# EAGLE design G848L (EAGLE 6.6.0)
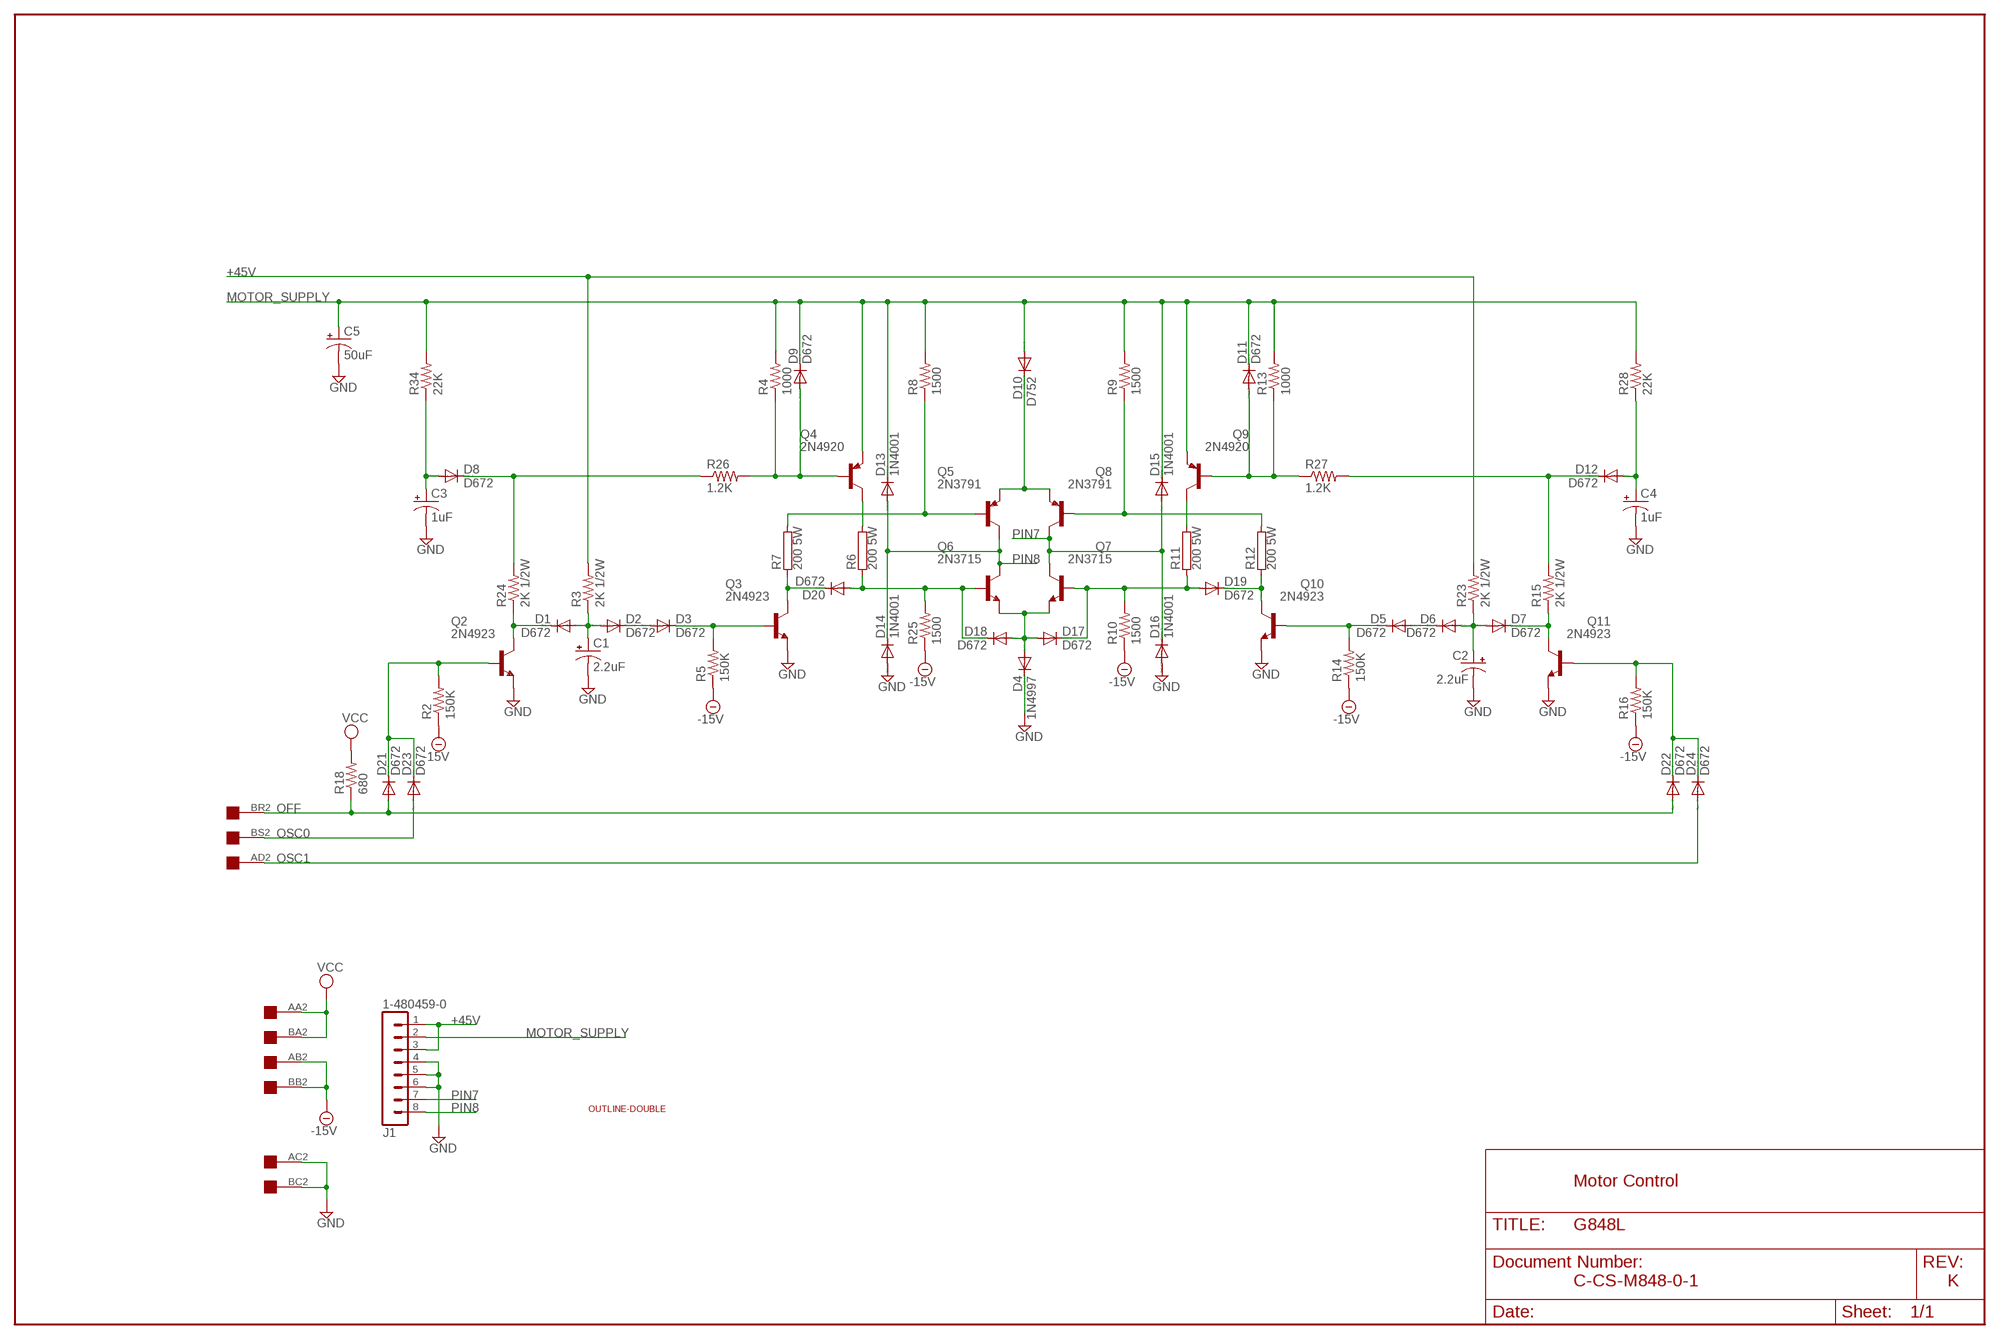
[diagram p0: schematic, sheet 1]

## Parts
C1  2.2uF  CPOL-USE15-5AXIAL  [E15-5]
C2  2.2uF  CPOL-USE15-5AXIAL  [E15-5]
C3  1uF  CPOL-USE15-5AXIAL  [E15-5]
C4  1uF  CPOL-USE15-5AXIAL  [E15-5]
C5  50uF  CPOL-USE30-10AXIAL  [E30-10]
D1  D672  DIODE-DO35-10  [DO35-10]
D2  D672  DIODE-DO35-10  [DO35-10]
D3  D672  DIODE-DO35-10  [DO35-10]
D4  1N4997  DIODE-G4-12  [G4-12]
D5  D672  DIODE-DO35-10  [DO35-10]
D6  D672  DIODE-DO35-10  [DO35-10]
D7  D672  DIODE-DO35-10  [DO35-10]
D8  D672  DIODE-DO35-10  [DO35-10]
D9  D672  DIODE-DO35-10  [DO35-10]
D10  D752  DIODE-G4-12  [G4-12]
D11  D672  DIODE-DO35-10  [DO35-10]
D12  D672  DIODE-DO35-10  [DO35-10]
D13  1N4001  1N4004  [DO41-10]
D14  1N4001  1N4004  [DO41-10]
D15  1N4001  1N4004  [DO41-10]
D16  1N4001  1N4004  [DO41-10]
D17  D672  DIODE-DO35-10  [DO35-10]
D18  D672  DIODE-DO35-10  [DO35-10]
D19  D672  DIODE-DO35-10  [DO35-10]
D20  D672  DIODE-DO35-10  [DO35-10]
D21  D672  DIODE-DO35-10  [DO35-10]
D22  D672  DIODE-DO35-10  [DO35-10]
D23  D672  DIODE-DO35-10  [DO35-10]
D24  D672  DIODE-DO35-10  [DO35-10]
J1  1-480459-0  [1-480459-0]
Q2  2N4923  -NPN-TO225HH  [TO225AHH]
Q3  2N4923  -NPN-TO225HH  [TO225AHH]
Q4  2N4920  -PNP-TO225HH  [TO225AHH]
Q5  2N3791  -PNP-TO3  [TO3]
Q6  2N3715  -NPN-TO3/  [TO3]
Q7  2N3715  -NPN-TO3/  [TO3]
Q8  2N3791  -PNP-TO3  [TO3]
Q9  2N4920  -PNP-TO225HH  [TO225AHH]
Q10  2N4923  -NPN-TO225HH  [TO225AHH]
Q11  2N4923  -NPN-TO225HH  [TO225AHH]
R2  150K  R-US_0207/10  [0207/10]
R3  2K 1/2W  R-US_0411/15  [0411/15]
R4  1000  R-US_0207/10  [0207/10]
R5  150K  R-US_0207/10  [0207/10]
R6  200 5W  RCA4090  [CA4090]
R7  200 5W  RCA4090  [CA4090]
R8  1500  R-US_0207/10  [0207/10]
R9  1500  R-US_0207/10  [0207/10]
R10  1500  R-US_0207/10  [0207/10]
R11  200 5W  RCA4090  [CA4090]
R12  200 5W  RCA4090  [CA4090]
R13  1000  R-US_0207/10  [0207/10]
R14  150K  R-US_0207/10  [0207/10]
R15  2K 1/2W  R-US_0411/15  [0411/15]
R16  150K  R-US_0207/10  [0207/10]
R18  680  R-US_0207/10  [0207/10]
R23  2K 1/2W  R-US_0411/15  [0411/15]
R24  2K 1/2W  R-US_0411/15  [0411/15]
R25  1500  R-US_0207/10  [0207/10]
R26  1.2K  R-US_0207/10  [0207/10]
R27  1.2K  R-US_0207/10  [0207/10]
R28  22K  R-US_0207/10  [0207/10]
R34  22K  R-US_0207/10  [0207/10]
U$1  DOUBLE  [EDGE-CON4]
U$2  OUTLINE-DOUBLE  [DOUBLE]

## Nets
+45V: J1.1 J1.3 R3.2 R23.2
-15V: R2.1 R5.1 R10.1 R14.1 R16.1 R25.1 U$1.AB2 U$1.BB2
GND: C1.- C2.- C3.- C4.- C5.- D4.C D14.A D16.A J1.4 J1.5 J1.6 Q2.1(E) Q3.1(E) Q10.1(E) Q11.1(E) U$1.AC2 U$1.BC2
MOTOR_SUPPLY: C5.+ D9.C D10.A D11.C D13.C D15.C J1.2 Q4.1(E) Q9.1(E) R4.2 R8.2 R9.2 R13.2 R28.2 R34.2
N$1: D21.C D23.C Q2.3(B) R2.2
N$2: D2.C D3.A
N$3: D5.A D6.C
N$4: C3.+ D8.A R34.1
N$5: D1.C Q2.2(C) R24.1
N$6: C1.+ D1.A D2.A R3.1
N$7: D8.C R24.2 R26.1
N$9: D3.C Q3.3(B) R5.2
N$10: Q4.2(C) R6.2
N$11: D20.C Q3.2(C) R7.1
N$12: Q5.B R7.2 R8.1
N$13: D18.C D20.A Q6.B R6.1 R25.2
N$14: D9.A Q4.3(B) R4.1 R26.2
N$15: D17.C D19.A Q7.B R10.2 R11.1
N$16: D4.A D17.A D18.A Q6.E Q7.E
N$17: D10.C Q5.E Q8.E
N$18: Q8.B R9.1 R12.2
N$19: Q9.2(C) R11.2
N$20: D19.C Q10.2(C) R12.1
N$21: D11.A Q9.3(B) R13.1 R27.1
N$22: D5.C Q10.3(B) R14.2
N$23: C2.+ D6.A D7.A R23.1
N$24: D7.C Q11.2(C) R15.1
N$25: D22.C D24.C Q11.3(B) R16.2
N$27: D12.C R15.2 R27.2
N$28: C4.+ D12.A R28.1
OFF: D21.A D22.A R18.1 U$1.BR2
OSC0: D23.A U$1.BS2
OSC1: D24.A U$1.AD2
PIN7: D15.A D16.C J1.7 Q7.C Q7.C/(C) Q8.C Q8.C/(C)
PIN8: D13.A D14.C J1.8 Q5.C Q5.C/(C) Q6.C Q6.C/(C)
VCC: R18.2 U$1.AA2 U$1.BA2
Unconnected: U$1.AA1 U$1.AB1 U$1.AC1 U$1.AD1 U$1.AE1 U$1.AE2 U$1.AF1 U$1.AF2 U$1.AH1 U$1.AH2 U$1.AJ1 U$1.AJ2 U$1.AK1 U$1.AK2 U$1.AL1 U$1.AL2 U$1.AM1 U$1.AM2 U$1.AN1 U$1.AN2 U$1.AP1 U$1.AP2 U$1.AR1 U$1.AR2 U$1.AS1 U$1.AS2 U$1.AT1 U$1.AT2 U$1.AU1 U$1.AU2 U$1.AV1 U$1.AV2 U$1.BA1 U$1.BB1 U$1.BC1 U$1.BD1 U$1.BD2 U$1.BE1 U$1.BE2 U$1.BF1 U$1.BF2 U$1.BH1 U$1.BH2 U$1.BJ1 U$1.BJ2 U$1.BK1 U$1.BK2 U$1.BL1 U$1.BL2 U$1.BM1 U$1.BM2 U$1.BN1 U$1.BN2 U$1.BP1 U$1.BP2 U$1.BR1 U$1.BS1 U$1.BT1 U$1.BT2 U$1.BU1 U$1.BU2 U$1.BV1 U$1.BV2

## Notes on the sheet
- Motor Control
- C-CS-M848-0-1 | K

## Library data of the parts
C1-C4 = dec-con:CPOL-USE15-5AXIAL: 0.6" version of an electrolytic
C5 = rcl:CPOL-US: POLARIZED CAPACITOR, American symbol
D1-D12 D17-D24 = diode:DIODE-: DIODE
D13-D16 = diode:1N4004: DIODE general purpose rectifier, 1 A
J1 = dec-con:1-480459-0: Mate-N-Lok 1-480459-0, board mounted.
Q2 Q3 Q6 Q7 Q10 Q11 = dec-con:*-NPN-: NPN Transistror BF959 corrected 2008.03.06
Q4 Q5 Q8 Q9 = dec-con:*-PNP-: PNP Transistror
R2-R5 R8-R10 R13-R16 R18 R23-R28 R34 = rcl:R-US_: RESISTOR, American symbol
R6 R7 R11 R12 = resistor-power:R: Power Resitor; OC_FARNELL: unknown; OC_NEWARK: unknown
U$1 = dec-con:DOUBLE: Double-Height DEC board
U$2 = dec-con:OUTLINE-*: Board outlines for DEC boards.

## Board
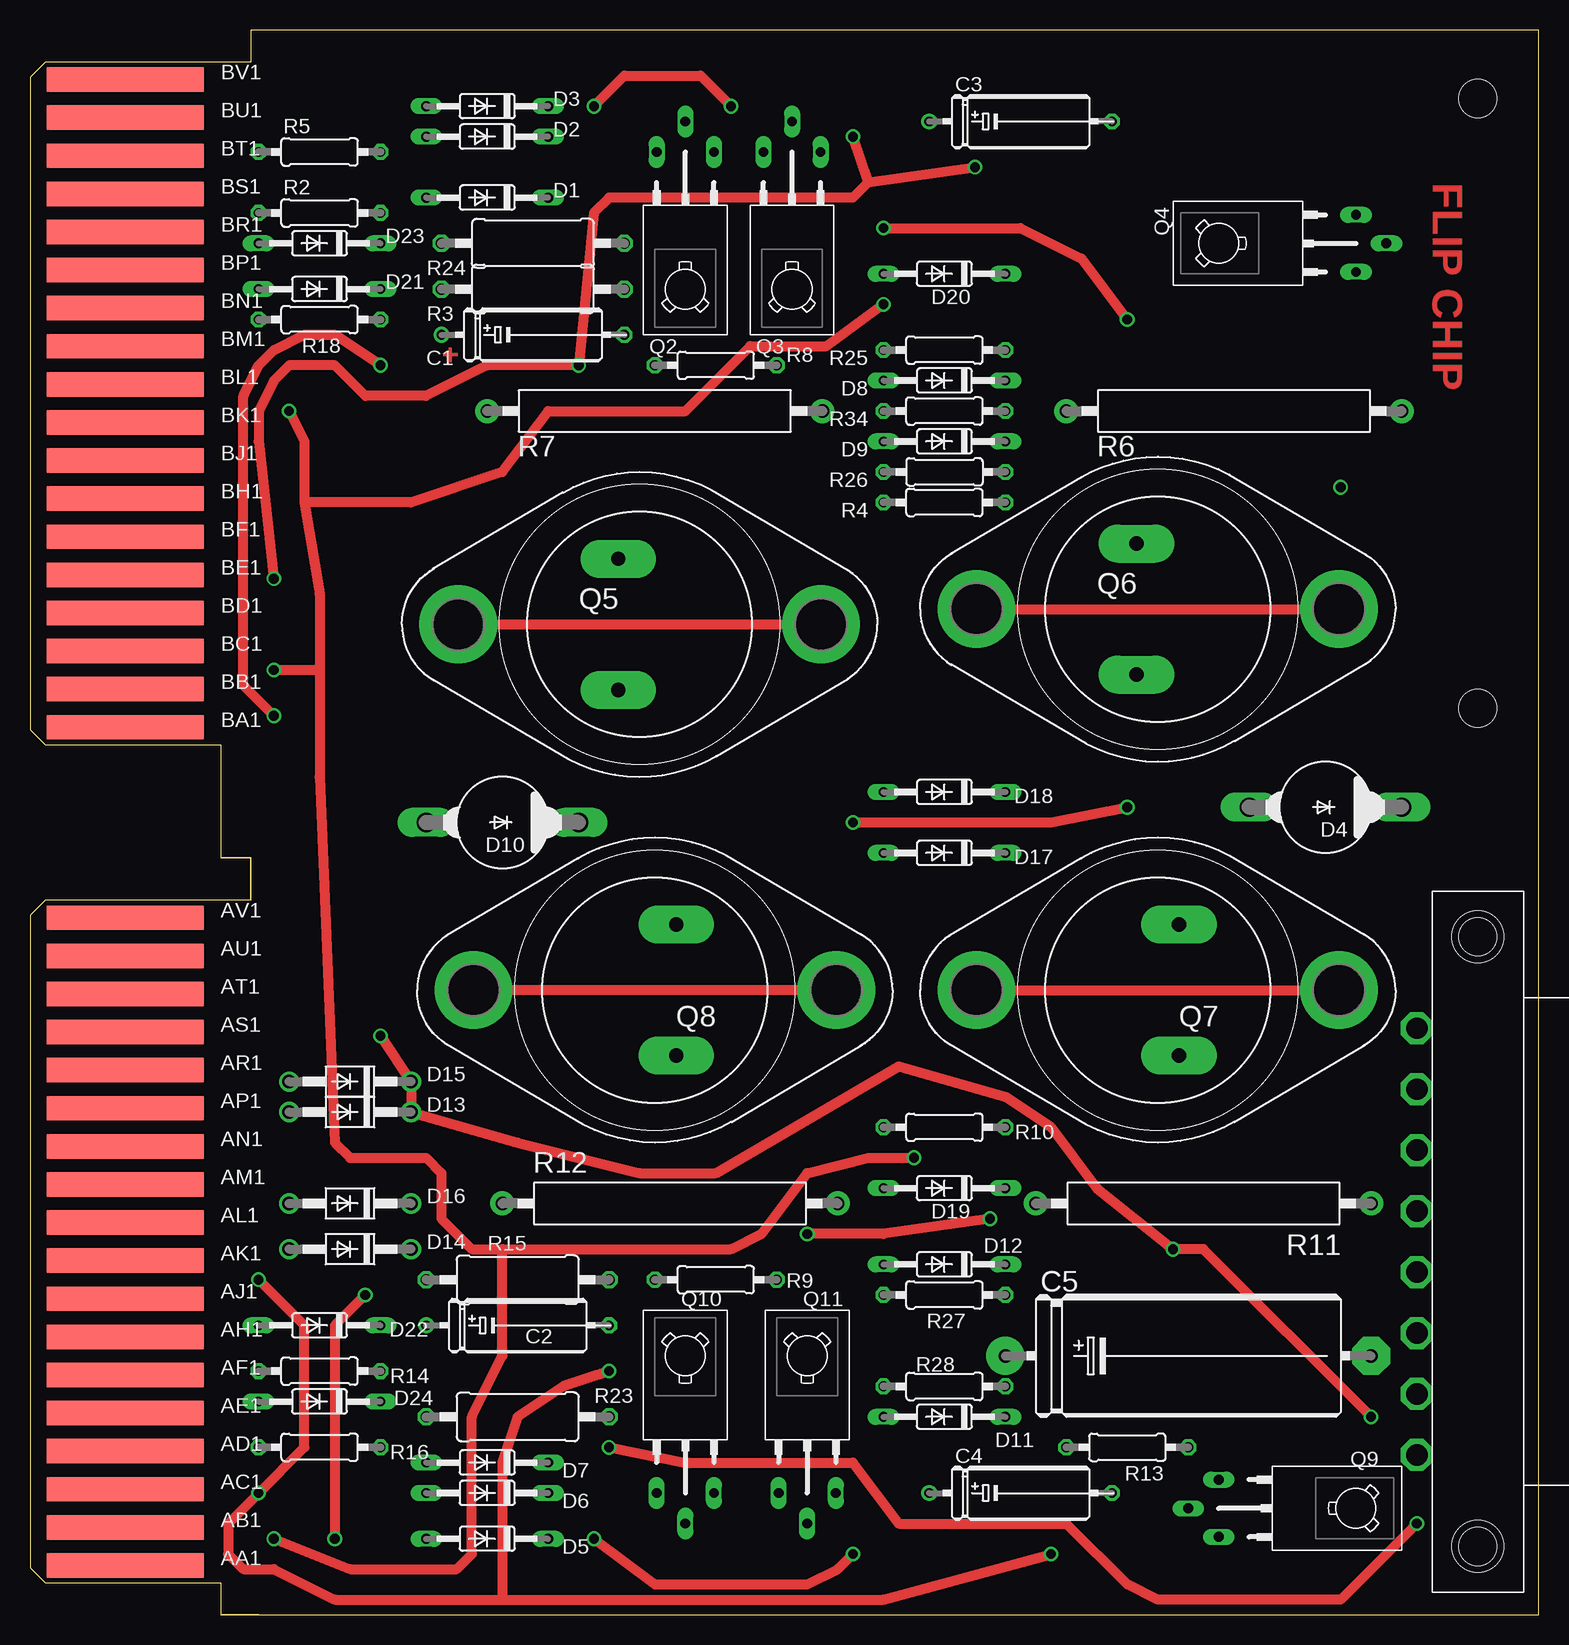
[diagram p1: board, top side]
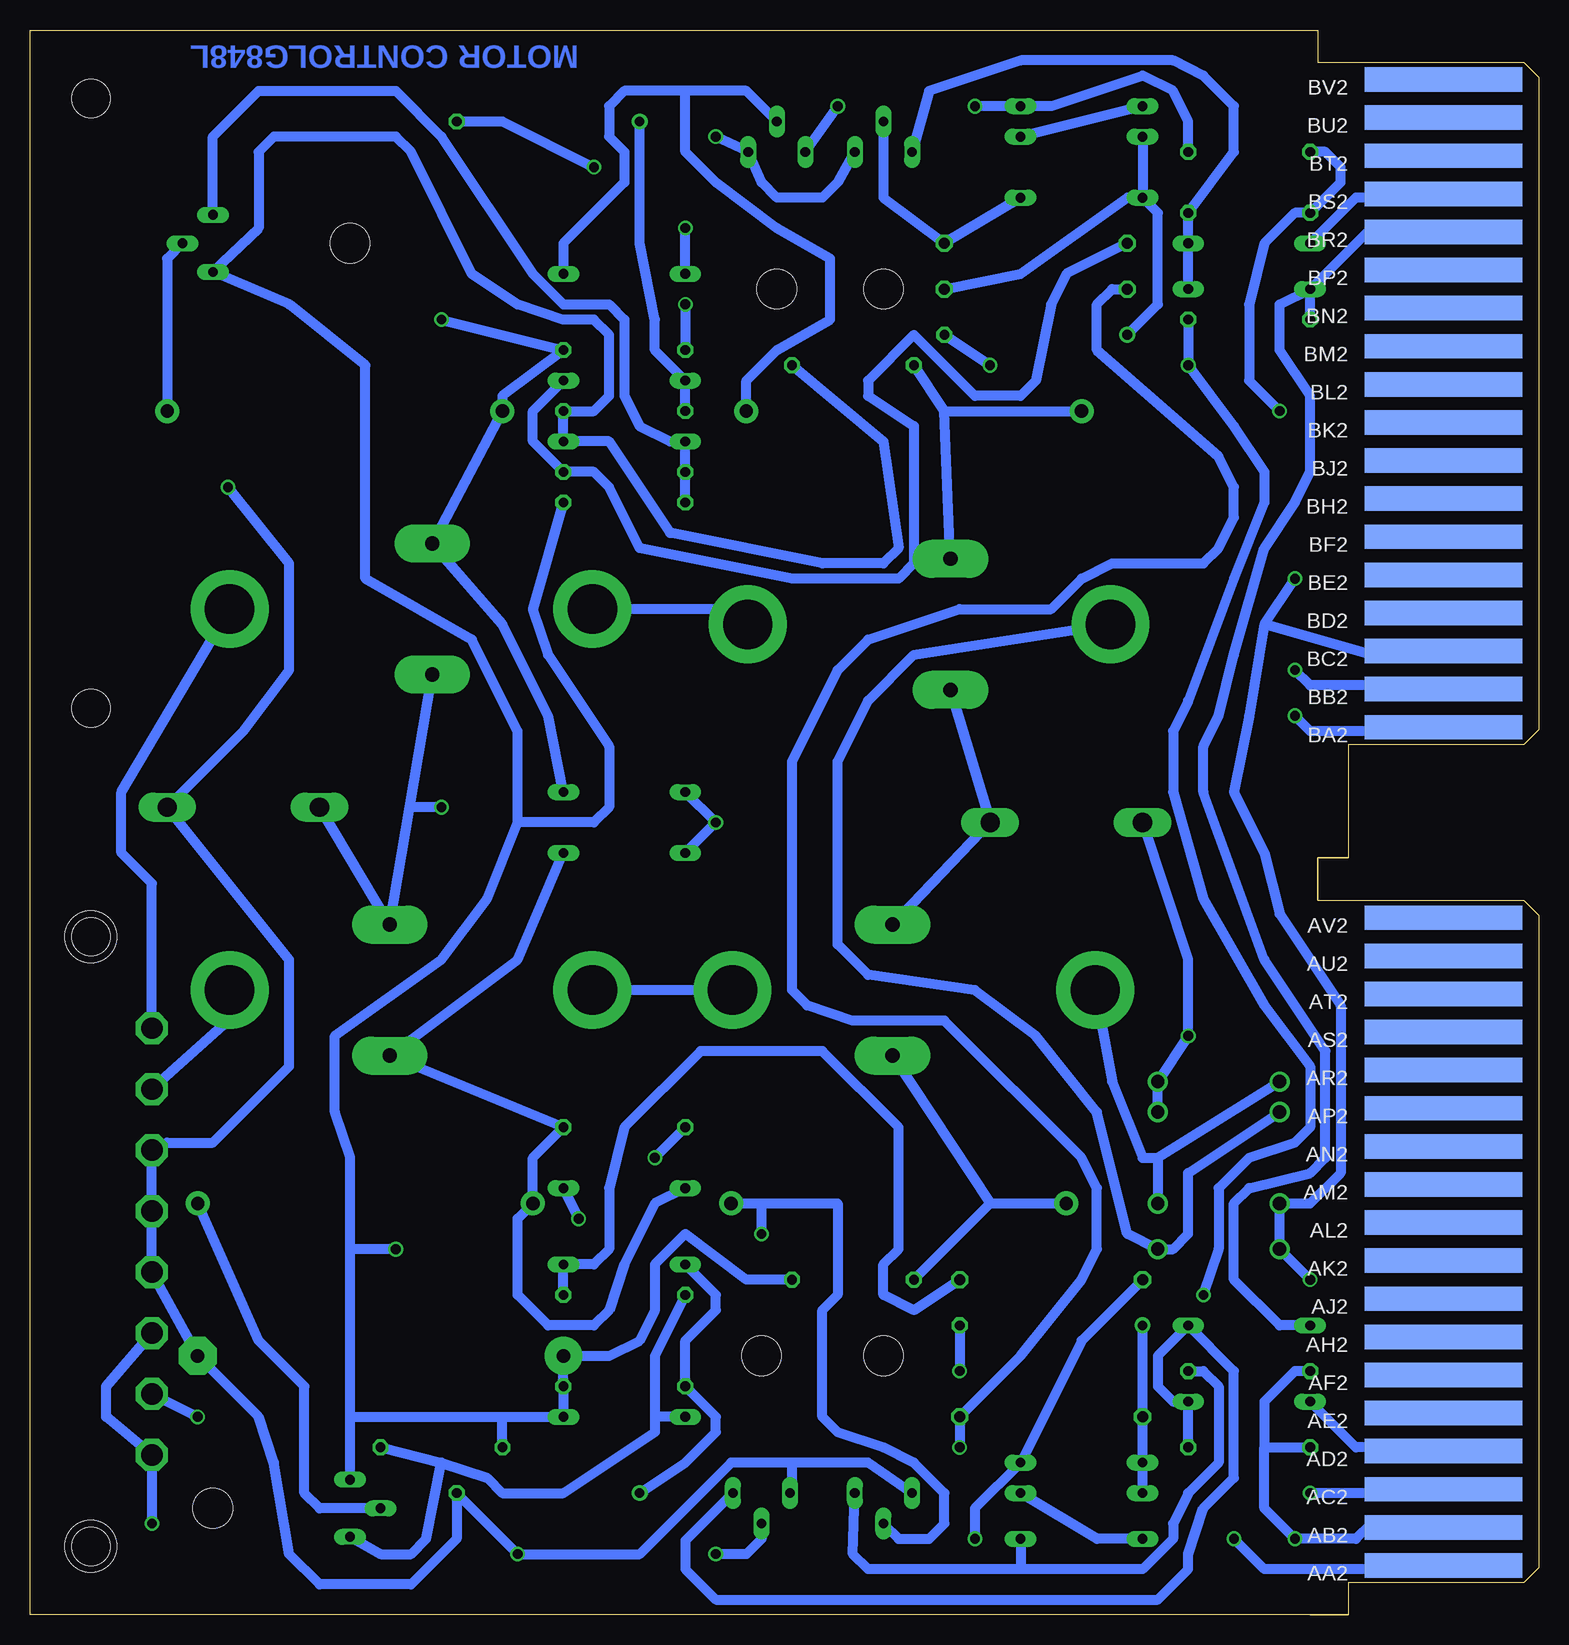
[diagram p2: board, bottom side, seen from below]

Size 125.73 x 132.08 mm. Coordinates in mm from the lower left corner, seen from the top.
Outline: 19.05,0 15.88,0
Copper layers (1+16): Top 0.035mm / dielectric 1.5mm / Bottom 0.035mm
Design rules "16mils": minimum track width 16mil, minimum drill 32mil, track to track 15mil, track to pad 10mil, pad to pad 10mil, via to via 10mil, smd to smd 10mil, copper to edge 13mil, drill to drill 10mil, minimum pad ring 10mil, minimum via ring 8mil, stop-mask expansion 0mil, vias tented up to drill 0mil, thermal gap 10mil

### Footprints (pad centres in the part's own frame; a part is rotated, then mirrored left to right if it is on the bottom)
E15-5 = drill 0.813: + -7.62,0 | drill 0.813 octagon: - 7.62,0
E30-10 = drill 1.118 pad 3.15: + -15.24,0 | drill 1.118 pad 3.15 octagon: - 15.24,0
DO35-10 = drill 0.813 long: A 5.08,0; C -5.08,0
G4-12 = drill 1.6 long: A 6.35,0; C -6.35,0
DO41-10 = drill 1.118: A 5.08,0; C -5.08,0
1-480459-0 = drill 1.778 octagon: 1 46.99,-1.27; 2 41.91,-1.27; 3 36.83,-1.27; 4 31.75,-1.27; 5 26.67,-1.27; 6 21.59,-1.27; 7 16.51,-1.27; 8 11.43,-1.27 | hole 4.318: 3.81,3.81; 54.61,3.81
TO225AHH = drill 0.813 long: 1 -2.381,-11.43; 2 0,-13.97; 3 2.381,-11.43 | hole 3.302: 0,0
TO3 = drill 1.194 pad 3.15 long: B -1.778,5.461; E -1.778,-5.461 | drill 4.115 pad 6.477: C 15.113,0; C/ -15.113,0
0207/10 = drill 0.813 octagon: 1 -5.08,0; 2 5.08,0
0411/15 = drill 0.914 octagon: 1 -7.62,0; 2 7.62,0
CA4090 = drill 1.1 pad 2: 1 -13.97,0; 2 13.97,0
EDGE-CON4 = smd 13.106 x 2.032: AA1 7.938,4.128; AB1 7.938,7.303; AC1 7.938,10.477; AD1 7.938,13.652; AE1 7.938,16.828; AF1 7.938,20.003; AH1 7.938,23.177; AJ1 7.938,26.352; AK1 7.938,29.527; AL1 7.938,32.703; AM1 7.938,35.877; AN1 7.938,39.053; AP1 7.938,42.227; AR1 7.938,45.403; AS1 7.938,48.578; AT1 7.938,51.752; AU1 7.938,54.928; AV1 7.938,58.102; BA1 7.938,73.978; BB1 7.938,77.153; BC1 7.938,80.328; BD1 7.938,83.502; BE1 7.938,86.677; BF1 7.938,89.853; BH1 7.938,93.028; BJ1 7.938,96.203; BK1 7.938,99.377; BL1 7.938,102.552; BM1 7.938,105.728; BN1 7.938,108.903; BP1 7.938,112.078; BR1 7.938,115.252; BS1 7.938,118.427; BT1 7.938,121.603; BU1 7.938,124.778; BV1 7.938,127.953 | smd 13.106 x 2.032 bottom: AA2 7.938,4.128; AB2 7.938,7.303; AC2 7.938,10.477; AD2 7.938,13.652; AE2 7.938,16.828; AF2 7.938,20.003; AH2 7.938,23.177; AJ2 7.938,26.352; AK2 7.938,29.527; AL2 7.938,32.703; AM2 7.938,35.877; AN2 7.938,39.053; AP2 7.938,42.227; AR2 7.938,45.403; AS2 7.938,48.578; AT2 7.938,51.752; AU2 7.938,54.928; AV2 7.938,58.102; BA2 7.938,73.978; BB2 7.938,77.153; BC2 7.938,80.328; BD2 7.938,83.502; BE2 7.938,86.677; BF2 7.938,89.853; BH2 7.938,93.028; BJ2 7.938,96.203; BK2 7.938,99.377; BL2 7.938,102.552; BM2 7.938,105.728; BN2 7.938,108.903; BP2 7.938,112.078; BR2 7.938,115.252; BS2 7.938,118.427; BT2 7.938,121.603; BU2 7.938,124.778; BV2 7.938,127.953
DOUBLE = hole 3.175: 120.65,56.515; 120.65,5.715; 120.65,75.565; 120.65,126.365

### Placement (x,y rotation side)
C1  41.91,106.68 0 top
C2  40.64,24.13 0 top
C3  82.55,124.46 0 top
C4  82.55,10.16 0 top
C5  96.52,21.59 0 top
D1  38.1,118.11 180 top
D2  38.1,123.19 180 top
D3  38.1,125.73 180 top
D4  107.95,67.31 180 top
D5  38.1,6.35 180 top
D6  38.1,10.16 180 top
D7  38.1,12.7 180 top
D8  76.2,102.87 180 top
D9  76.2,97.79 180 top
D10  39.37,66.04 180 top
D11  76.2,16.51 180 top
D12  76.2,29.21 180 top
D13  26.67,41.91 180 top
D14  26.67,30.48 180 top
D15  26.67,44.45 180 top
D16  26.67,34.29 180 top
D17  76.2,63.5 180 top
D18  76.2,68.58 180 top
D19  76.2,35.56 180 top
D20  76.2,111.76 180 top
D21  24.13,110.49 180 top
D22  24.13,24.13 180 top
D23  24.13,114.3 180 top
D24  24.13,17.78 180 top
J1  116.84,60.33 270 top
Q2  54.61,110.49 180 top
Q3  63.5,110.49 180 top
Q4  99.06,114.3 90 top
Q5  50.8,82.55 0 top
Q6  93.98,83.82 0 top
Q7  93.98,52.07 180 top
Q8  52.07,52.07 180 top
Q9  110.49,8.89 270 top
Q10  54.61,21.59 0 top
Q11  64.77,21.59 0 top
R2  24.13,116.84 0 top
R3  41.91,110.49 180 top
R4  76.2,92.71 0 top
R5  24.13,121.92 0 top
R6  100.33,100.33 0 top
R7  52.07,100.33 180 top
R8  57.15,104.14 0 top
R9  57.15,27.94 0 top
R10  76.2,40.64 0 top
R11  97.79,34.29 0 top
R12  53.34,34.29 180 top
R13  91.44,13.97 180 top
R14  24.13,20.32 0 top
R15  40.64,27.94 0 top
R16  24.13,13.97 0 top
R18  24.13,107.95 0 top
R23  40.64,16.51 0 top
R24  41.91,114.3 180 top
R25  76.2,105.41 0 top
R26  76.2,95.25 180 top
R27  76.2,26.67 0 top
R28  76.2,19.05 0 top
R34  76.2,100.33 0 top
U$1  0,0 0 top
U$2  0,0 0 top
U$3  [FLIPCHIP]  121.92,138.43 180 top  (outside the outline)

### Tracks (layer width: path | path; a pad name or v marks a point on that pad's centre or on a via)
+45V  (via drill 0.81)
  Top 0.813: v115.57,7.62 109.22,1.27 93.98,1.27 91.44,2.54 86.36,7.62 72.39,7.62 68.58,12.7 54.61,12.7 v48.26,13.97
  Bottom 0.813: J1.3 119.38,19.05 119.38,16.51 J1.1 v115.57,7.62 | v48.26,13.97 R23.2 43.18,21.59 38.1,27.94 36.83,30.48 36.83,35.56 38.1,38.1 49.53,49.53 57.15,49.53 60.96,50.8 62.23,52.07 62.23,71.12 58.42,78.74 55.88,81.28 48.26,83.82 40.64,83.82 38.1,86.36 35.56,87.63 27.94,87.63 26.67,88.9 25.4,91.44 25.4,93.98 26.67,96.52 36.83,105.41 36.83,109.22 35.56,110.49 R3.2
-15V  (via drill 0.81, 0.81 pad 0.25)
  Top 0.813: v21.59,100.33 22.86,97.79 22.86,92.71 | 22.86,92.71 31.75,92.71 39.37,95.25 43.18,100.33 54.61,100.33 60.01,105.73 66.36,105.73 v71.12,109.22 | 22.86,92.71 24.13,85.09 24.13,78.74 | 24.13,78.74 v20.32,78.74 | 24.13,78.74 24.13,69.85 25.4,39.37 26.67,38.1 33.02,38.1 34.29,36.83 34.29,33.02 36.83,30.48 39.37,30.48 | 39.37,30.48 58.42,30.48 60.96,31.75 64.77,36.83 69.85,38.1 v73.66,38.1 | v20.32,6.35 26.67,3.81 35.56,3.81 36.83,5.08 36.83,16.51 39.37,21.59 39.37,30.48
  Bottom 0.813: R5.1 17.78,121.92 16.51,120.65 16.51,119.38 R2.1 20.32,116.84 22.86,114.3 24.13,109.22 24.13,102.87 v21.59,100.33 | U$1.BB2 8.26,77.47 19.05,77.47 v20.32,78.74 | U$1.AB2 8.89,7.62 13.97,7.62 15.24,6.35 v20.32,6.35 22.86,8.89 22.86,13.97 | 22.86,13.97 R16.1 | R14.1 20.32,20.32 22.86,17.78 22.86,13.97 | R10.1 v73.66,38.1 | v71.12,109.22 R25.1
GND  (via drill 0.81, 0.81 pad 0.25)
  Top 0.813: v19.05,27.94 22.86,24.13 22.86,13.97 v19.05,10.16 16.51,7.62 16.51,5.08 17.78,3.81 20.32,3.81 25.4,1.27 39.37,1.27 | 39.37,1.27 71.12,1.27 v85.09,5.08 | v48.26,20.32 44.45,19.05 40.64,16.51 39.37,12.7 39.37,1.27 | v68.58,123.19 69.85,119.38 | 69.85,119.38 v78.74,120.65 | 69.85,119.38 68.58,118.11 48.26,118.11 46.99,116.84 v45.72,104.14 38.1,104.14 33.02,101.6 27.94,101.6 25.4,104.14 21.59,104.14 20.32,102.87 19.05,100.33 19.05,97.79 v20.32,86.36
  Bottom 0.813: C3.- 86.36,124.46 v78.74,120.65 | Q2.1 58.42,119.38 59.69,118.11 63.5,118.11 64.77,119.38 Q3.1 v68.58,123.19 | U$1.BC2 8.57,80.33 8.89,80.01 13.97,80.01 22.86,82.55 | 22.86,82.55 v20.32,86.36 | 22.86,82.55 24.13,74.93 25.4,68.58 22.86,63.5 21.59,58.42 16.51,50.8 16.51,36.83 19.05,34.29 D16.A D14.A v19.05,27.94 | U$1.AC2 8.89,10.16 v19.05,10.16 | Q10.1 55.88,12.7 62.23,12.7 | 62.23,12.7 67.31,12.7 74.93,5.08 v85.09,5.08 C4.- 90.17,6.35 93.98,2.54 101.6,2.54 104.14,5.08 105.41,12.7 106.68,16.51 C5.- J1.4 J1.5 J1.6 114.3,39.37 110.49,39.37 104.14,45.72 104.14,54.61 D4.C 107.95,73.66 104.14,78.74 104.14,87.63 v109.22,93.98 | Q11.1 62.23,10.32 62.23,12.7 | C2.- v48.26,20.32 | v45.72,104.14 C1.-
MOTOR_SUPPLY  (via drill 0.81, 0.81 pad 0.25)
  Top 0.813: v29.21,48.26 D15.C D13.C 40.64,39.37 50.8,36.83 57.15,36.83 72.39,45.72 81.28,43.18 85.09,40.64 88.9,35.56 v95.25,30.48 97.79,30.48 v111.76,16.51
  Bottom 0.813: R13.2 86.36,16.51 | 86.36,16.51 D11.C R28.2 C5.+ 77.47,21.59 74.93,22.86 73.66,25.4 73.66,29.21 71.12,31.75 66.04,27.94 R9.2 | Q9.1 99.06,16.51 | 99.06,16.51 86.36,16.51 | J1.2 v111.76,16.51 | D13.C D15.C v29.21,48.26 29.21,54.61 D10.A | R8.2 54.61,97.79 53.34,88.9 54.61,87.63 59.69,87.63 72.39,90.17 77.47,97.79 D9.C R34.2 78.74,100.33 77.47,101.6 77.47,106.68 78.74,107.95 81.28,107.95 85.09,109.22 88.9,111.76 93.98,121.92 95.25,123.19 105.41,123.19 106.68,121.92 106.68,115.57 Q4.1 104.14,109.22 97.79,104.14 97.79,86.36 88.9,81.28 85.09,73.66 85.09,66.04 | R4.2 83.82,83.82 82.55,80.01 77.47,72.39 77.47,67.31 78.74,66.04 85.09,66.04 | 99.06,16.51 99.06,30.48 | 99.06,30.48 99.06,38.1 100.33,41.91 100.33,48.26 91.44,54.61 87.63,59.69 85.09,66.04 | v95.25,30.48 99.06,30.48
N$1
  Bottom 0.813: D21.C D23.C R2.2 25.4,121.92 25.4,125.73 27.94,128.27 30.48,129.54 43.18,129.54 50.8,127 Q2.3
N$2
  Bottom 0.813: D3.A D2.C
N$3
  Bottom 0.813: D5.A 36.83,6.35 D6.C
N$4
  Bottom 0.813: R34.1 D8.A 73.66,105.41 73.66,107.95 74.93,114.3 C3.+
N$5
  Bottom 0.813: D1.C R24.1 54.61,118.11 Q2.2
N$6
  Bottom 0.813: D2.A D1.A | R3.1 43.18,111.76 34.29,118.11 D1.A | C1.+ 31.75,109.22 31.75,116.84 D1.A
N$7
  Bottom 0.813: R24.2 39.37,111.76 40.64,109.22 41.91,102.87 43.18,101.6 46.99,101.6 52.07,106.68 55.88,102.87 55.88,101.6 52.07,99.06 52.07,87.63 53.34,86.36 62.23,86.36 74.93,88.9 77.47,93.98 78.74,95.25 R26.1 83.82,97.79 83.82,100.33 D8.C
N$9  (via drill 0.81)
  Top 0.813: v46.99,125.73 49.53,128.27 55.88,128.27 v58.42,125.73
  Bottom 0.813: Q3.3 v58.42,125.73 | v46.99,125.73 D3.C 40.64,125.73 33.02,128.27 30.48,127 29.21,124.46 R5.2
N$10
  Bottom 0.813: Q4.2 114.3,113.03 R6.2
N$11
  Bottom 0.813: Q3.2 66.04,127 71.12,127 | 71.12,127 76.2,127 77.47,125.73 77.47,123.19 76.2,121.92 76.2,119.38 81.28,114.3 D20.C | R7.1 66.04,102.87 63.5,105.41 59.06,107.95 59.06,113.03 63.5,115.57 68.58,119.38 71.12,121.92 71.12,127
N$12
  Bottom 0.813: Q5.B 49.53,100.33 | 49.53,100.33 R7.2 | 49.53,100.33 R8.1
N$13  (via drill 0.81, 0.81 pad 0.25)
  Top 0.813: v71.12,115.57 82.55,115.57 87.63,113.03 v91.44,107.95
  Bottom 0.813: D18.C 82.55,74.93 86.36,82.55 Q6.B R6.1 86.36,101.6 R25.2 v91.44,107.95 | D20.A v71.12,115.57
N$14
  Bottom 0.813: R4.1 R26.2 D9.A 72.39,97.79 74.93,99.06 76.2,101.6 76.2,107.95 77.47,109.22 81.28,109.22 83.82,111.76 91.44,123.19 95.25,127 106.68,127 110.49,123.19 Q4.3
N$15
  Bottom 0.813: D17.C 85.09,54.61 Q7.B R10.2 83.82,38.1 R11.1 85.09,33.02 85.09,26.67 82.55,24.13 78.74,24.13 77.47,25.4 76.2,29.21 73.66,34.29 D19.A
N$16  (via drill 0.81, 0.81 pad 0.25)
  Top 0.813: v68.58,66.04 85.09,66.04 v91.44,67.31
  Bottom 0.813: D17.A v68.58,66.04 D18.A | D4.A Q7.E 94.09,67.33 | 94.09,67.33 Q6.E | v91.44,67.31 94.09,67.33
N$17
  Bottom 0.813: Q8.E D10.C Q5.E
N$18
  Bottom 0.813: R9.1 45.72,34.29 | 45.72,34.29 R12.2 | 45.72,34.29 Q8.B
N$19
  Bottom 0.813: Q9.2 101.6,8.89 102.87,10.16 102.87,19.05 106.68,22.86 R11.2
N$20  (via drill 0.81, 0.81 pad 0.25)
  Top 0.813: v80.01,33.02 71.12,31.75 v64.77,31.75
  Bottom 0.813: Q10.2 53.34,6.35 50.8,6.35 49.53,7.62 49.53,10.16 52.07,12.7 54.61,13.97 58.42,15.24 59.69,16.51 59.69,25.4 58.42,26.67 58.42,34.29 64.77,34.29 | R12.1 64.77,34.29 | D19.C v80.01,33.02 | v64.77,31.75 64.77,34.29
N$21
  Bottom 0.813: R27.1 73.66,21.59 73.66,16.51 | 73.66,16.51 73.66,15.24 81.28,10.16 86.36,10.16 87.63,11.43 91.44,12.7 | D11.A 73.66,16.51 | Q9.3 96.52,5.08 93.98,5.08 92.71,6.35 91.44,12.7 | R13.1 91.44,12.7
N$22
  Bottom 0.813: R14.2 27.94,20.32 26.67,19.05 26.67,12.7 29.21,10.16 30.48,7.62 30.48,6.35 33.02,3.81 43.18,3.81 | D5.C 43.18,3.81 | 43.18,3.81 55.88,3.81 57.15,5.08 Q10.3
N$23
  Bottom 0.813: D6.A D7.A R23.1 C2.+
N$24  (via drill 0.81)
  Top 0.813: v46.99,6.35 52.07,2.54 64.77,2.54 67.31,3.81 v68.58,5.08
  Bottom 0.813: R15.1 38.1,22.86 D7.C 46.99,8.89 v46.99,6.35 | Q11.2 64.77,6.35 66.04,5.08 v68.58,5.08
N$25
  Bottom 0.813: R16.2 D24.C 30.48,17.78 31.75,19.05 31.75,21.59 D22.C 25.4,20.32 25.4,11.43 27.94,8.89 29.21,5.08 29.21,3.81 31.75,1.27 68.58,1.27 71.12,3.81 71.12,6.19 Q11.3
N$27
  Bottom 0.813: R27.2 D12.C 78.74,29.21 77.47,30.48 77.47,35.56 76.2,40.64 69.85,46.99 59.69,46.99 53.34,40.64 53.34,30.48 54.61,29.21 54.61,26.67 52.07,25.4 R15.2
N$28
  Bottom 0.813: C4.+ 71.12,12.7 68.58,15.24 68.58,16.51 R28.1 71.12,22.86 68.58,25.4 68.58,26.67 D12.A
OFF
  Bottom 0.813: U$1.BR2 8.26,115.57 13.97,115.57 D21.A | R18.1 D21.A | D22.A 21.59,24.13 25.4,27.94 25.4,34.29 24.13,35.56 19.05,36.83 17.78,38.1 17.78,46.99 22.86,54.61 27.94,68.58 27.94,72.39 26.67,74.93 25.4,80.01 22.86,88.9 20.32,92.71 19.05,95.25 19.05,101.6 21.59,105.41 21.59,109.22 D21.A
OSC0
  Bottom 0.813: U$1.BS2 8.26,118.11 15.24,118.11 D23.A
OSC1
  Bottom 0.813: U$1.AD2 8.89,13.97 15.24,13.97 D24.A
PIN7
  Top 0.813: Q7.C Q7.C/ | Q8.C/ Q8.C
  Bottom 0.813: D15.A 31.75,38.1 | 31.75,38.1 D16.C | J1.7 109.22,49.53 Q7.C/ | Q8.C/ Q7.C | Q8.C 35.56,44.45 33.02,38.1 31.75,38.1
PIN8
  Top 0.813: Q5.C/ Q5.C | Q6.C/ Q6.C
  Bottom 0.813: D13.A 29.21,36.83 29.21,31.75 30.48,30.48 D14.C 34.29,31.75 36.83,41.91 41.91,48.26 46.99,52.07 55.88,53.34 58.42,55.88 58.42,71.12 55.88,76.2 52.07,80.01 Q5.C/ | J1.8 115.57,60.96 118.11,63.5 118.11,68.58 Q6.C | Q5.C 67.31,83.82 Q6.C/
VCC  (via drill 0.81)
  Top 0.813: v20.32,74.93 17.78,77.47 17.78,101.6 19.05,104.14 20.32,105.41 22.86,106.68 25.4,106.68 v29.21,104.14 | v27.94,26.67 25.4,24.13 v25.4,6.35
  Bottom 0.813: U$1.BA2 8.57,73.98 8.89,73.66 19.05,73.66 v20.32,74.93 | U$1.AA2 8.89,3.81 22.86,3.81 v25.4,6.35 | R18.2 v29.21,104.14 25.4,99.06 22.86,95.25 22.86,92.71 25.4,86.36 29.21,76.2 30.48,73.66 30.48,68.58 27.94,59.69 22.86,50.8 19.05,45.72 19.05,40.64 20.32,39.37 24.13,38.1 26.67,35.56 26.67,30.48 v27.94,26.67

### Text on the board
Top: +
Bottom: MOTOR CONTROL | G848L
tPlace: Need to draw polygons!
200bmp: //wsl$/Debian/home/vrs/Eagle/projects/DEC/Gxxx/G848/G848Lfront.bmp
201bmp: //wsl$/Debian/home/vrs/Eagle/projects/DEC/Gxxx/G848/G848Lbackf.bmp